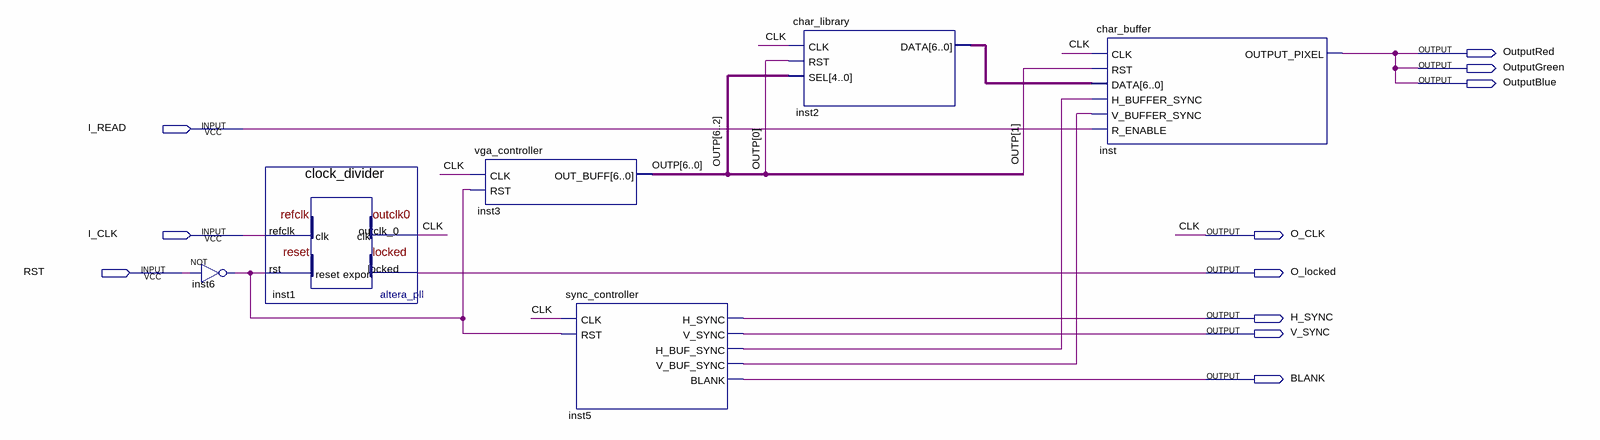
[diagram p0: schematic sheet]
// Quartus schematic VGA_driver.bdf as structural Verilog: 6 symbols, 11 pins
module VGA_driver (
  input  I_READ,
  input  I_CLK,
  input  RST,
  output OutputRed,
  output OutputGreen,
  output OutputBlue,
  output O_CLK,
  output O_locked,
  output H_SYNC,
  output V_SYNC,
  output BLANK
);

  wire inst5_h_buf_sync, inst5_v_buf_sync, inst6_out;
  wire [6:0] inst2_data, OUTP;

  not inst6 (inst6_out, RST);
  clock_divider inst1 (.refclk(I_CLK), .rst(inst6_out), .outclk_0(O_CLK), .locked(O_locked));
  vga_controller inst3 (.CLK(O_CLK), .RST(inst6_out), .OUT_BUFF(OUTP));
  sync_controller inst5 (
    .CLK(O_CLK), .RST(inst6_out), .H_SYNC(H_SYNC), .V_SYNC(V_SYNC), .H_BUF_SYNC(inst5_h_buf_sync),
    .V_BUF_SYNC(inst5_v_buf_sync), .BLANK(BLANK));
  char_library inst2 (.CLK(O_CLK), .RST(OUTP[0]), .SEL(OUTP[6:2]), .DATA(inst2_data));
  char_buffer inst (
    .CLK(O_CLK), .RST(OUTP[1]), .DATA(inst2_data), .H_BUFFER_SYNC(inst5_h_buf_sync),
    .V_BUFFER_SYNC(inst5_v_buf_sync), .R_ENABLE(I_READ), .OUTPUT_PIXEL(OutputBlue));

  assign OutputGreen = OutputBlue;
  assign OutputRed = OutputBlue;

  // Other names for the same wires on the sheet: CLK = O_CLK
endmodule
